# EAGLE board ngff-breakout (EAGLE 7.7.0)
VERSION: v3
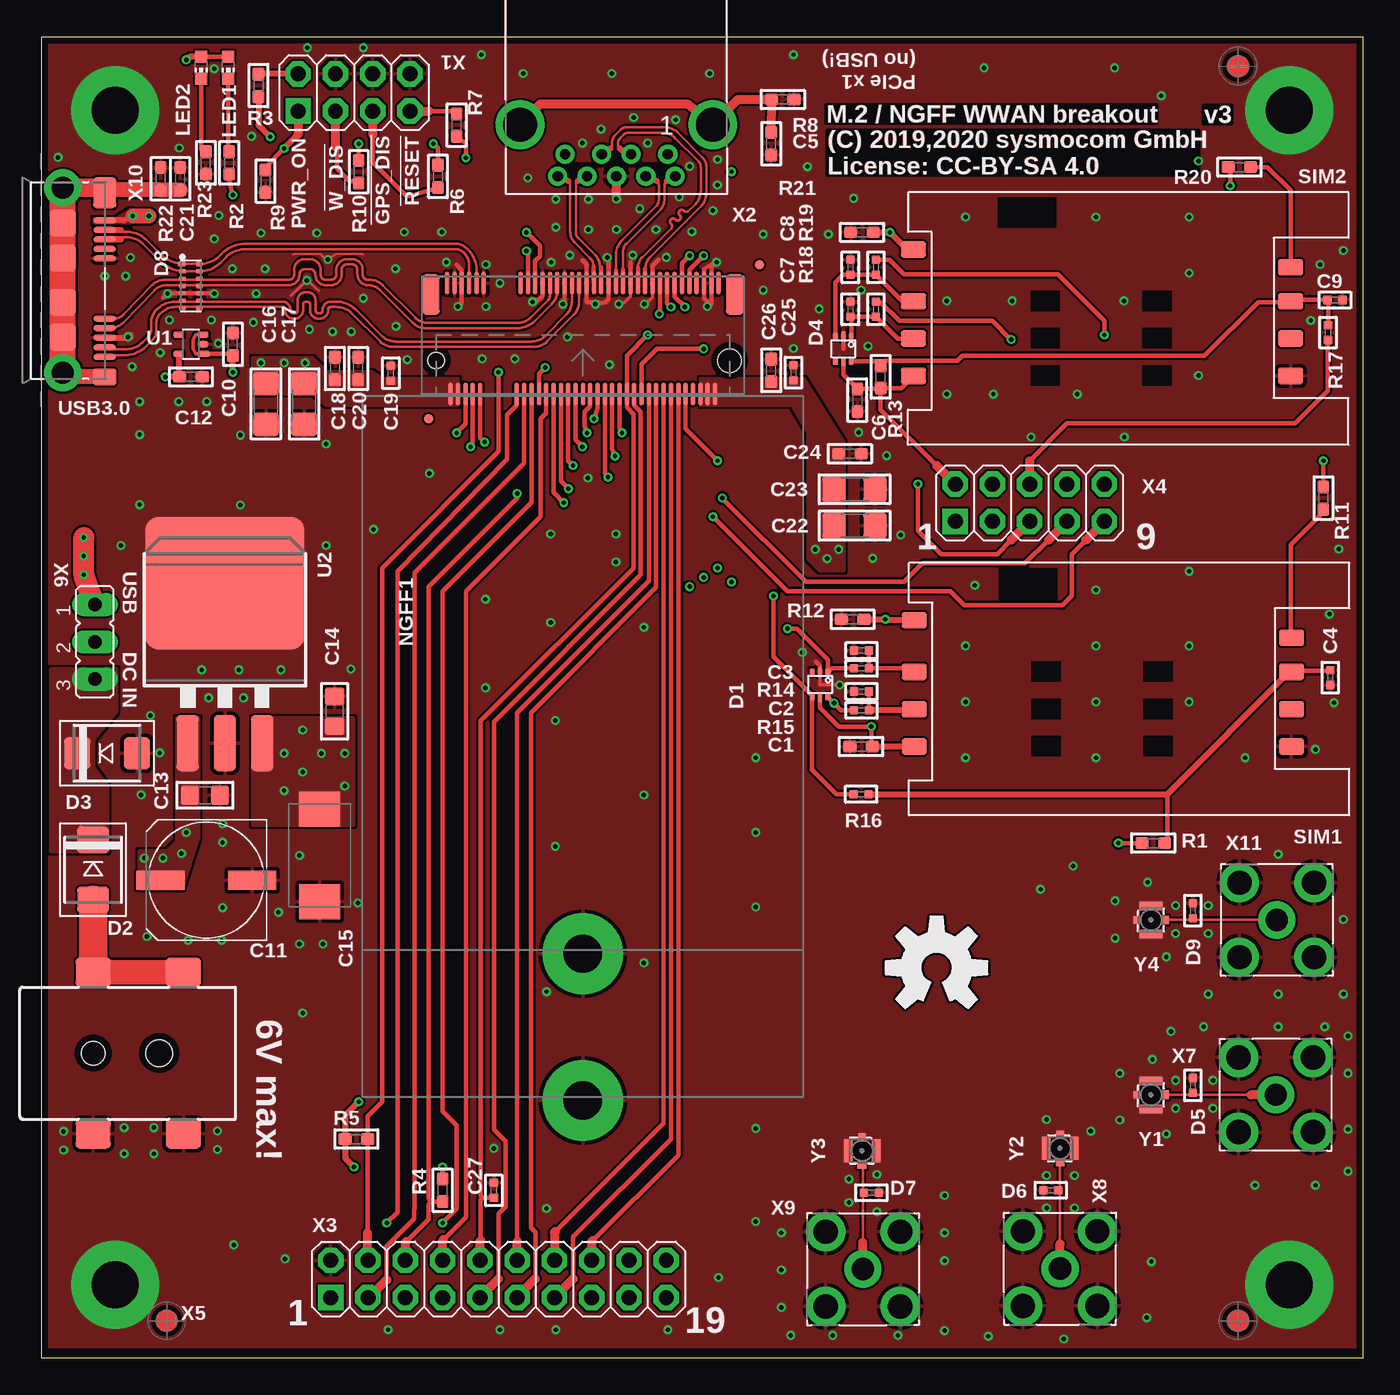
[diagram p1: board, top side]
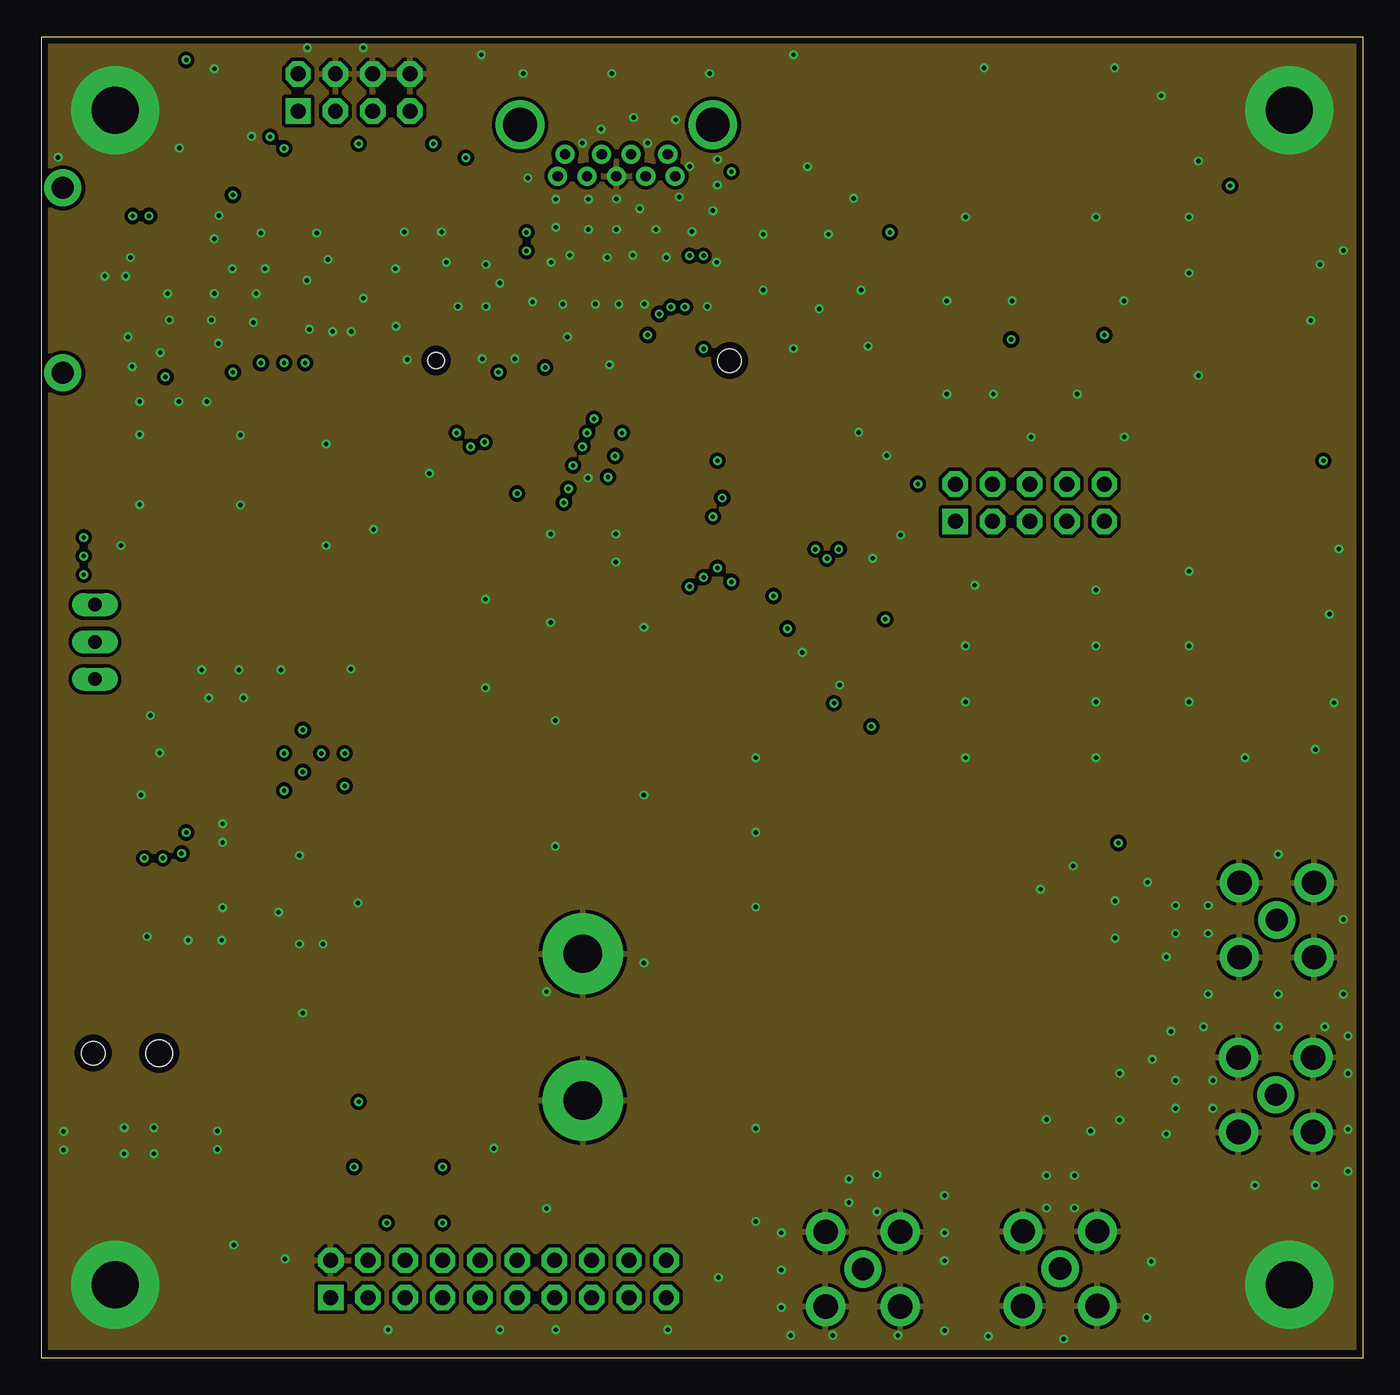
[diagram p2: board, inner layer Route2]
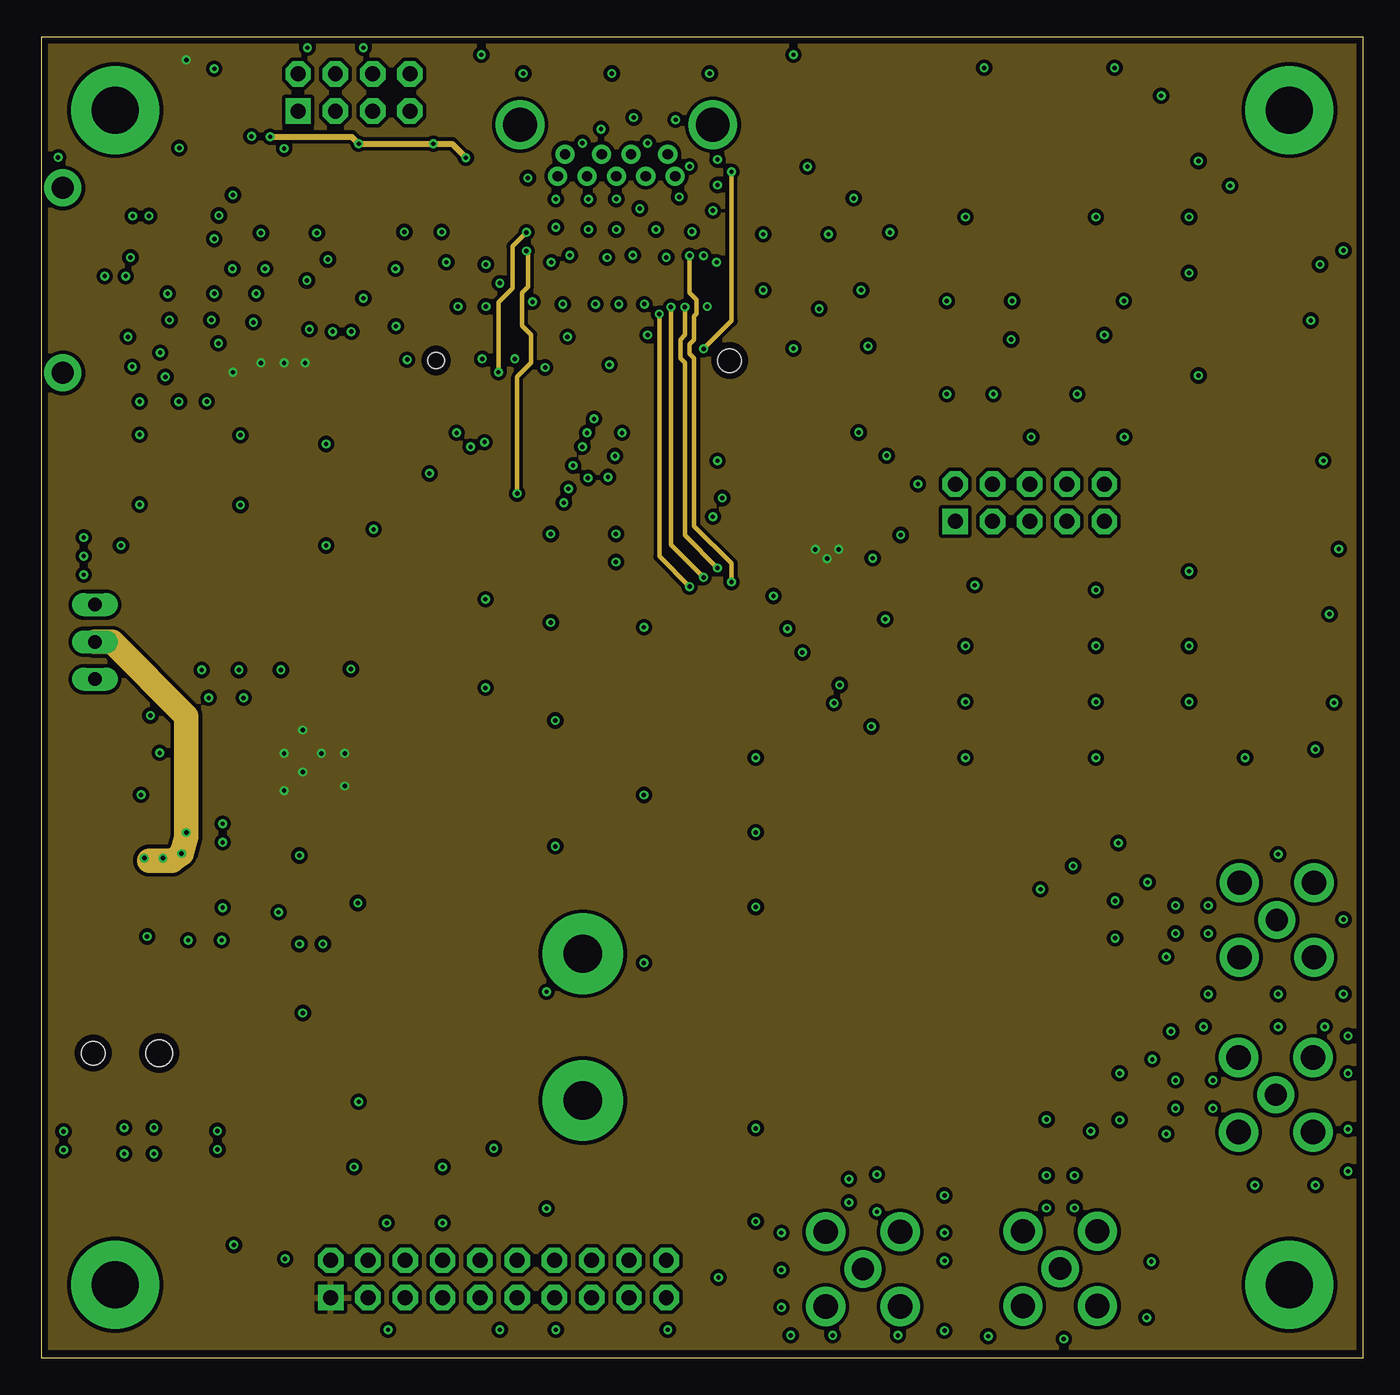
[diagram p3: board, inner layer Route15]
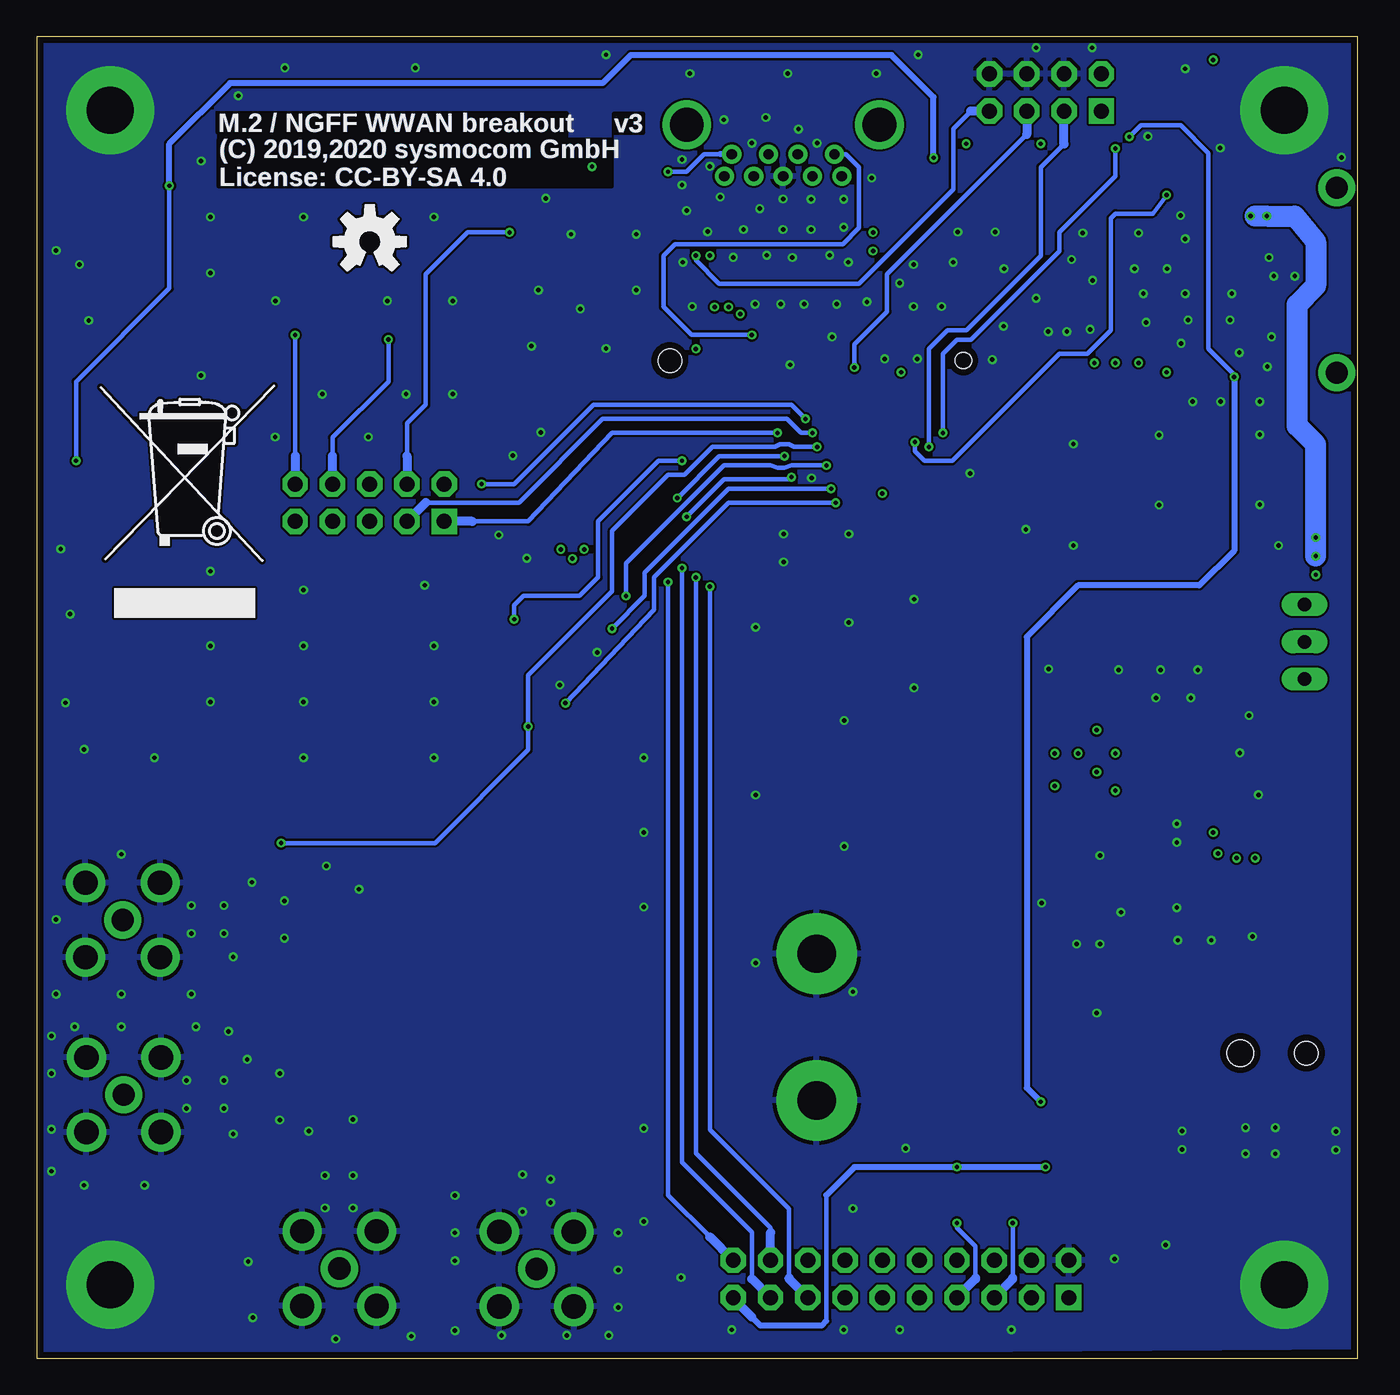
[diagram p4: board, bottom side, seen from below]

Size 90 x 90 mm. Coordinates in mm from the lower left corner, seen from the top.
Outline: 90,0 0,0 0,90 90,90 90,0
Copper layers (1+2*15+16): Top 0.035mm / dielectric 0.46mm / Route2 0.035mm / dielectric 0.55mm / Route15 0.035mm / dielectric 0.46mm / Bottom 0.035mm
Design rules "sysmocom-4layer": minimum track width 0.15mm, minimum drill 0.3mm, track to track 0.15mm, track to pad 0.15mm, pad to pad 0.15mm, via to via 0.15mm, smd to smd 0mil, copper to edge 0.45mm, drill to drill 0.3mm, minimum pad ring 0.15mm, minimum via ring 0.15mm, stop-mask expansion 0mil, vias tented up to drill 0mil, thermal gap 10mil
Net classes: 0 default: clearance 0.25 mm; 1 usb: width 0.185 mm, clearance 0.195 mm; 2 50 ohm: width 0.9 mm, clearance 0.152 mm; 3 supply: width 0.6 mm, clearance 0.3 mm to class 0
tRestrict: area 35.6,81.1 to 42.9,81.4

## Footprints (pad centres in the part's own frame; a part is rotated, then mirrored left to right if it is on the bottom)
_0603 = smd 0.9 x 0.8: 1 -0.762,0; 2 0.762,0
_0402 = smd 0.6 x 0.6: 1 -0.508,0; 2 0.508,0
UD-8X10_NICHICON = smd 3.3 x 1.3: + 3.125,0; - -3.125,0
_0805 = smd 1.2 x 1.3: 1 -1.016,0; 2 1.016,0
SMC_E = smd 2.4 x 2.8: + -3.15,0; - 3.15,0
1206 = smd 1.6 x 1.8: 1 -1.4,0; 2 1.4,0
SOT666 = smd 0.375 x 0.5: 1 -0.538,-0.85; 3 0.538,-0.85; 4 0.538,0.85; 6 -0.538,0.85 | smd 0.3 x 0.6: 2 0,-0.9; 5 0,0.9
SMBDIODE = smd 1.78 x 2.16: A 2.04,0; C -2.03,0
UDFN-14 = smd 0.3 x 0.6: 1 -1.5,-0.625 | smd 0.3 x 0.5: 2 -1,-0.575; 3 -0.5,-0.575; 4 0,-0.575; 5 0.5,-0.575; 6 1,-0.575; 7 1.5,-0.575; 8 1.5,0.575; 9 1,0.575; 10 0.5,0.575; 11 0,0.575; 12 -0.5,0.575; 13 -1,0.575; 14 -1.5,0.575
MICRO-FIDUCIAL = smd 0.635 x 0.635: 1 0,0
CHIP-LED0603 = smd 0.8 x 0.8: A 0,-0.75; C 0,0.75
NGFF_3042_3052_NSOL = smd 0.3 x 1.55: 1 -9.25,5.275; 2 -9,-2.275; 3 -8.75,5.275; 4 -8.5,-2.275; 5 -8.25,5.275; 6 -8,-2.275; 7 -7.75,5.275; 8 -7.5,-2.275; 9 -7.25,5.275; 10 -7,-2.275; 11 -6.75,5.275; 20 -4.5,-2.275; 21 -4.25,5.275; 22 -4,-2.275; 23 -3.75,5.275; 24 -3.5,-2.275; 25 -3.25,5.275; 26 -3,-2.275; 27 -2.75,5.275; 28 -2.5,-2.275; 29 -2.25,5.275; 30 -2,-2.275; 31 -1.75,5.275; 32 -1.5,-2.275; 33 -1.25,5.275; 34 -1,-2.275; 35 -0.75,5.275; 36 -0.5,-2.275; 37 -0.25,5.275; 38 0,-2.275; 39 0.25,5.275; 40 0.5,-2.275; 41 0.75,5.275; 42 1,-2.275; 43 1.25,5.275; 44 1.5,-2.275; 45 1.75,5.275; 46 2,-2.275; 47 2.25,5.275; 48 2.5,-2.275; 49 2.75,5.275; 50 3,-2.275; 51 3.25,5.275; 52 3.5,-2.275; 53 3.75,5.275; 54 4,-2.275; 55 4.25,5.275; 56 4.5,-2.275; 57 4.75,5.275; 58 5,-2.275; 59 5.25,5.275; 60 5.5,-2.275; 61 5.75,5.275; 62 6,-2.275; 63 6.25,5.275; 64 6.5,-2.275; 65 6.75,5.275; 66 7,-2.275; 67 7.25,5.275; 68 7.5,-2.275; 69 7.75,5.275; 70 8,-2.275; 71 8.25,5.275; 72 8.5,-2.275; 73 8.75,5.275; 74 9,-2.275; 75 9.25,5.275 | smd 1.2 x 2.75: MNT1 -10.35,4.5; MNT2 10.35,4.5 | drill 2.6 pad 5.5: P$1 0,-40.394; P$2 0,-50.394 | hole 1.1: -10,0 | hole 1.6: 10,0
SF7W008S1A-RESTR = smd 1.7 x 1.1: 1 12.85,3.9; 2 12.85,1.36; 3 12.85,-1.18; 5 -12.85,3.9; 6 -12.85,1.36; 7 -12.85,-1.18; 81 12.85,-4.7; 82 -12.85,-3.5
SC70-5 = smd 0.4 x 0.8: 1 -0.65,-0.9 | smd 0.4 x 0.7: 2 0,-0.85; 3 0.65,-0.85; 4 0.65,0.85; 5 -0.65,0.85
TO263 = smd 1.524 x 3.81: 1 -2.54,-8.255; 2 0,-8.255; 3 2.54,-8.255 | smd 10.8 x 9: 4 0,2.635
2X04 = drill 1.016 square: 1 -3.81,-1.27 | drill 1.016 octagon: 2 -3.81,1.27; 3 -1.27,-1.27; 4 -1.27,1.27; 5 1.27,-1.27; 6 1.27,1.27; 7 3.81,-1.27; 8 3.81,1.27
692121030100 = drill 0.7 pad 1.3: 1 -3.5,-1.5; 2 -1,-1.5; 3 1,-1.5; 4 3.5,-1.5; 5 4,0; 6 2,0; 7 0,0; 8 -2,0; 9 -4,0 | drill 2.3 pad 3.3: SHELL -6.57,-3.5; SHELL1 6.57,-3.5
2X10 = drill 1.016 square: 1 -11.43,-1.27 | drill 1.016 octagon: 2 -11.43,1.27; 3 -8.89,-1.27; 4 -8.89,1.27; 5 -6.35,-1.27; 6 -6.35,1.27; 7 -3.81,-1.27; 8 -3.81,1.27; 9 -1.27,-1.27; 10 -1.27,1.27; 11 1.27,-1.27; 12 1.27,1.27; 13 3.81,-1.27; 14 3.81,1.27; 15 6.35,-1.27; 16 6.35,1.27; 17 8.89,-1.27; 18 8.89,1.27; 19 11.43,-1.27; 20 11.43,1.27
2X05 = drill 1.016 square: 1 -5.08,-1.27 | drill 1.016 octagon: 2 -5.08,1.27; 3 -2.54,-1.27; 4 -2.54,1.27; 5 0,-1.27; 6 0,1.27; 7 2.54,-1.27; 8 2.54,1.27; 9 5.08,-1.27; 10 5.08,1.27
694108106102 = smd 2.4 x 2: 1 11.15,5.5; 1-1 5,5.5; 2 5,-5.5; 3 11.15,-5.5 | hole 1.6: 5,0 | hole 1.8: 9.5,0
JP2 = drill 0.914 long: 1 -2.54,0; 2 0,0; 3 2.54,0
SMA-F-S-TH = drill 1.524: C 0,0 | drill 1.651: G1 -2.54,2.54; G2 2.54,2.54; G3 -2.54,-2.54; G4 2.54,-2.54
ZX360D-B = smd 0.4 x 1.5: 1 -1.3,0; 2 -0.65,0; 3 0,0; 4 0.65,0; 5 1.3,0; 6 5.4,0; 7 6.05,0; 8 6.7,0; 9 7.35,0; 10 8,0 | drill 1.5: S1 -3.5,-2.85; S2 9.1,-2.85 | smd 2.1 x 1.6: S3 -3.175,0 | smd 1.1 x 1.6: S4 9.366,0 | smd 1.8 x 1.8: S5 -1.111,-2.857; S6 1.27,-2.857; S7 4.286,-2.857; S8 6.668,-2.857
MURATA_HSC = smd 0.6 x 0.55: 1 0,-0.953 | smd 0.58 x 1.58: P$1 -0.953,0; P$2 0.953,0 | smd 0.5 x 0.5: P$4 0,0.953

## Placement (x,y rotation side)
C1  100n  [_0603]  55.82,41.66 0 top
C2  33p  [_0402]  55.85,45.4 180 top
C3  33p  [_0402]  55.85,48.19 180 top
C4  33p  [_0402]  87.79,46.35 270 top
C5  100n  [_0603]  49.69,82.71 90 top
C6  100n  [_0603]  55.56,65.25 90 top
C7  33p  [_0402]  55.09,71.44 90 top
C8  33p  [_0402]  55.09,74.3 90 top
C9  33p  [_0402]  88.11,72.07 0 top
C10  100n  [_0603]  13.02,69.06 270 top
C11  470u  [UD-8X10_NICHICON]  11.21,32.56 180 top
C12  100n  [_0603]  10.16,66.83 180 top
C13  10u  [_0805]  11.11,38.34 180 top
C14  10u  [_0805]  19.94,44.05 270 top
C15  DNP  [SMC_E]  18.92,34.24 270 top
C16  100u  [1206]  15.27,64.99 90 top
C17  100u  [1206]  17.87,64.99 90 top
C18  100n  [_0603]  19.97,67.4 270 top
C19  33p  [_0402]  23.78,67.09 90 top
C20  10p  [_0603]  21.56,67.4 90 top
C21  100n  [_0603]  9.43,80.33 270 top
C22  100u  [1206]  55.37,56.7 180 top
C23  100u  [1206]  55.37,59.18 180 top
C24  100n  [_0603]  55.05,61.59 180 top
C25  33p  [_0402]  51.21,67.12 90 top
C26  10p  [_0603]  49.69,67.28 90 top
C27  33p  [_0402]  30.8,11.43 90 top
D1  PESD5V0UBV  [SOT666]  53.02,45.88 180 top
D2  SD2114S040S5R0  [SMBDIODE]  3.49,33.26 270 top
D3  SMBJP6KE6.8A-TP  [SMBDIODE]  4.45,41.2 0 top
D4  PESD5V0UBV  [SOT666]  54.61,68.74 180 top
D5  GG040205170N2P  [_0402]  78.42,18.57 270 top
D6  GG040205170N2P  [_0402]  68.74,11.43 0 top
D7  GG040205170N2P  [_0402]  56.52,11.27 180 top
D8  SP3012-6UTG  [UDFN-14]  10.16,73.02 270 top
D9  GG040205170N2P  [_0402]  78.42,30.48 270 top
FID1  [VISION_REF15]  81.5,2.54 0 top
FID2  [VISION_REF15]  8.5,2.54 0 top
FID3  [VISION_REF15]  81.5,88 0 top
JP1  FIDUCIALUFIDUCIAL  [MICRO-FIDUCIAL]  48.9,74.45 0 top
JP2  FIDUCIALUFIDUCIAL  [MICRO-FIDUCIAL]  26.35,63.98 0 top
LED1  YELLOW  [CHIP-LED0603]  12.7,87.88 180 top
LED2  GREEN  [CHIP-LED0603]  10.86,87.88 180 top
LOGO1  OSHW-LOGOL-COPPER  [OSHW-LOGO-L_COPPER]  60.96,26.59 0 top
NGFF1  NGFF_B-NSOL  [NGFF_3042_3052_NSOL]  36.86,67.94 0 top
R1  DNP  [_0603]  75.72,35.08 0 top
R2  330  [_0603]  12.76,81.4 270 top
R3  10k  [_0603]  14.76,86.68 270 top
R4  10k  [_0603]  27.3,11.43 90 top
R5  10k  [_0603]  21.43,14.92 180 top
R6  10k  [_0603]  26.99,80.48 90 top
R7  10k  [_0603]  28.26,83.98 270 top
R8  330  [_0603]  50.48,85.72 180 top
R9  100k  [_0603]  15.24,80.17 90 top
R10  10k  [_0603]  21.59,80.8 90 top
R11  4.7k  [_0603]  87.31,58.58 270 top
R12  47k  [_0603]  55.24,50.32 0 top
R13  DNP  [_0603]  57.15,66.83 90 top
R14  47  [_0402]  55.85,46.99 0 top
R15  47  [_0402]  55.85,44.13 0 top
R16  47  [_0402]  55.82,38.42 0 top
R17  47  [_0402]  87.63,69.85 90 top
R18  47  [_0402]  56.83,71.44 270 top
R19  47  [_0402]  56.83,74.29 270 top
R20  4.7k  [_0603]  81.6,81.12 0 top
R21  47k  [_0603]  55.88,76.67 0 top
R22  330  [_0603]  8.1,80.33 270 top
R23  330  [_0603]  11.18,81.4 90 top
SIM1  SF7W008S1A-R  [SF7W008S1A-RESTR]  72.29,45.56 180 top
SIM2  SF7W008S1A-R  [SF7W008S1A-RESTR]  72.23,70.8 180 top
U1  MIC5366-1.8YC5  [SC70-5]  10.16,69.06 90 top
U2  MCP1827S-3302E/EB  [TO263]  12.48,50.15 0 top
U$1  [WEEE_BIN_TOP]  80.33,59.53 0 bottom
U$2  [WEEE_BIN]  80.33,56.99 0 bottom
U$3  [OSHW-LOGO-M_COPPER]  67.31,76.04 0 bottom
U$4  [OSHW-LOGO-M]  67.31,76.04 0 bottom
U$7  [OSHW-LOGO-L]  60.96,26.59 0 top
X1  PINHD-2X4  [2X04]  21.27,86.2 0 top
X2  692121030100  [692121030100]  39.15,80.5 180 top
X3  PINHD-2X10  [2X10]  31.11,5.4 0 top
X4  PINHD-2X5  [2X05]  67.31,58.26 0 top
X5  PJ-002BH-SMT-TR  [694108106102]  -1.5,20.78 0 top
X6  PINHD-1X3  [JP2]  3.62,48.78 270 top
X7  5-1814832-2  [SMA-F-S-TH]  84.07,17.94 180 top
X8  5-1814832-2  [SMA-F-S-TH]  69.37,6.1 90 top
X9  5-1814832-2  [SMA-F-S-TH]  55.94,6.06 0 top
X10  ZX360D-B-10P(30)  [ZX360D-B]  4.29,76.2 270 top
X11  5-1814832-2  [SMA-F-S-TH]  84.14,29.84 270 top
Y1  MHF4  [MURATA_HSC]  75.56,17.94 90 top
Y2  MHF4  [MURATA_HSC]  69.37,14.29 0 top
Y3  MHF4  [MURATA_HSC]  55.88,14.13 0 top
Y4  MHF4  [MURATA_HSC]  75.56,29.84 90 top

## Tracks (layer width: path | path; a pad name or v marks a point on that pad's centre or on a via)
!BODY_SAR  (via drill 0.3)
  Top 0.254: X3.4 22.19,6.7 22.19,6.99
  Top 0.305: NGFF1.25 33.61,74.73 33.93,75.04 33.93,75.77 v33.02,76.67 | v31.11,67.15 31.11,61.75 23.5,54.1 23.18,53.78 23.18,17.46 22.19,16.48 R5.1 22.19,8.54
  Top 0.61: 22.19,6.71 22.19,6.99 22.19,8.54
  Route15 0.305: v33.02,76.67 32.07,75.72 32.07,72.86 31.11,71.91 v31.11,67.15
!CLKREQ
  Top 0.254: 29.91,4.19 X3.9
  Top 0.305: NGFF1.52 40.36,64.89 40.8,64.45 40.8,53.34 30.8,43.34 30.8,15.56 31.59,14.76 31.59,10.32 31.11,9.84 31.11,5.4
  Top 0.6: 29.91,4.19 31.11,5.4
!GPS_DISABLE  (via drill 0.3)
  Top 0.305: NGFF1.26 33.86,67.04 v34.29,67.47 | 22.54,83.34 22.54,81.44 24.89,79.09 R6.1
  Top 0.6: X1.5 22.54,83.34
  Bottom 0.305: v34.29,67.47 34.29,69.06 32.07,71.28 32.07,73.82 22.54,83.34
  Bottom 0.6: X1.5 22.54,83.34
!PERST  (via drill 0.3)
  Top 0.305: 29.91,8 29.91,10.79 30.04,10.92 | v41.27,69.69 39.86,68.28 NGFF1.50 39.86,64.75 40.32,64.29 40.32,53.81 29.91,43.4 29.91,11.05 30.04,10.92 | C27.1 30.04,10.92
  Top 0.61: 29.91,8 29.86,7.95 29.86,6.68 X3.10
  Bottom 0.305: v41.27,69.69 45.4,69.69 47.31,71.59 47.31,75.09 46.51,75.88 35.08,75.88 33.97,76.99 33.97,81.12 34.85,82 X2.4
!RESET  (via drill 0.3)
  Top 0.305: NGFF1.67 44.11,74.11 v45.09,75.09 | 26.35,84.93 28.07,84.93 R7.1
  Top 0.6: X1.7 26.35,84.93
  Bottom 0.305: v45.09,75.09 45.09,74.77 43.5,73.18 33.97,73.18 27.56,79.6 27.56,83.72 26.35,84.93
  Bottom 0.6: X1.7 26.35,84.93
!USIM1_RESET
  Top 0.305: R15.2 C2.1
  Top 0.406: SIM1.2 59.38,44.13 R15.2
!USIM2_RESET
  Top 0.305: 58.79,69.44 SIM2.2 58.32,69.44 R18.2 C7.1 55.15,70.87 D4.1
!W_DISABLE  (via drill 0.3)
  Top 0.305: NGFF1.8 29.36,62.22 v29.21,62.07 | R10.1 21.78,80.17 20.95,80.17 20.13,80.99 20.13,82.39
  Top 0.406: 20.13,82.39 20,82.52
  Top 0.6: 20,82.52 X1.3
  Bottom 0.305: v29.21,62.07 29.21,68.74 27.94,70.01 26.67,70.01 21.59,75.09 21.59,81.12 20.13,82.58
  Bottom 0.406: 20.13,82.58 20,82.71
  Bottom 0.6: 20,82.71 X1.3
!WAKE  (via drill 0.3)
  Top 0.305: NGFF1.54 40.86,67.69 41.91,68.74 v45.09,68.74
  Route15 0.305: v45.09,68.74 46.99,70.64 v46.99,80.8
  Bottom 0.305: 43.42,82 44.52,82 45.72,80.8 v46.99,80.8
  Bottom 0.406: X2.1 43.42,82
!WAKE_ON_WWAN  (via drill 0.3)
  Top 0.305: 24.83,7.94 26.35,9.46 26.35,10.48 26.54,10.67 | R4.1 26.54,10.67 | v32.38,58.9 32.38,58.58 26.35,52.55 26.35,10.86 26.54,10.67 | v33.02,75.41 33.11,75.31 NGFF1.23
  Top 0.61: 24.83,7.94 24.78,7.89 X3.6
  Route15 0.305: v32.38,58.9 32.38,66.83 33.34,67.78 33.34,69.69 32.7,70.33 32.7,72.55 33.11,72.96 33.11,75.31 v33.02,75.41
_!USIM1_RESET  (via drill 0.3)
  Top 0.305: R15.1 54.46,44.13 v53.98,44.61 | NGFF1.30 34.86,58.96 v35.56,58.26 | v53.98,44.61 D1.6 | v53.98,44.61
  Bottom 0.305: v35.56,58.26 42.86,58.26 47.94,53.18 47.94,50.96 v53.98,44.61
_!USIM2_RESET  (via drill 0.3)
  Top 0.305: NGFF1.46 38.86,61.94 v39.05,61.44 | 68.58,55.72 66.99,54.13 60.01,54.13 58.74,52.86 52.07,52.86 v46.35,58.58
  Top 0.61: X4.7 68.58,55.72
  Bottom 0.305: v39.05,61.44 43.5,61.44 v46.35,58.58
_SIM2_DET  (via drill 0.3)
  Top 0.305: NGFF1.40 37.36,64.82 36.99,64.45 36.99,63.5 v37.15,63.02
  Bottom 0.305: v37.15,63.02 37.94,63.02 38.89,63.98 51.44,63.98 57.15,58.26 63.5,58.26
  Bottom 0.61: 63.5,58.26 X4.3
_USB_D_N
  Top 0.18: NGFF1.9 29.61,74.11 arc45 29.02,75.53 arc45 28.13,75.91 13.92,75.91 arc45 12.25,75.22 12.14,75.11 arc-45 D8.14 9.74,74.52 arc-45 8.07,75.22 7.11,76.17 arc45 5.77,76.72 5.48,76.72 5.4,76.85
  Top 0.406: X10.2 5.4,76.85
_USB_D_P
  Top 0.152: 5.4,76.2 5.24,76.2
  Top 0.18: X10.3 arc-45 4.61,76.33 5.83,76.33 arc-45 6.86,75.91 8,74.77 arc45 9.8,74.02 D8.13 arc45 12.17,74.62 12.51,74.96 arc-45 13.92,75.54 28.13,75.54 arc-45 28.76,75.28 arc-45 29.11,74.44 NGFF1.7
  Top 0.406: X10.3 5.4,76.2
_USIM1_CLK  (via drill 0.3)
  Top 0.305: v35.88,59.21 35.36,59.73 NGFF1.32 | R14.1 53.82,46.99 D1.1 53.56,47.56 51.44,49.69 v50.8,49.69
  Bottom 0.305: v35.88,59.21 42.86,59.21 48.58,53.5 48.58,51.91 v50.8,49.69
_USIM1_DATA  (via drill 0.3)
  Top 0.305: R16.1 54.13,38.42 52.48,40.07 D1.4 52.48,45.15 49.85,47.78 v49.85,51.91 | NGFF1.34 35.86,61.13 v36.2,60.8
  Bottom 0.305: v36.2,60.8 38.58,60.8 39.05,60.64 39.53,60.64 40.01,60.8 43.18,60.8 49.85,54.13 v49.85,51.91
_USIM2_CLK  (via drill 0.3)
  Top 0.305: NGFF1.44 38.36,60.22 v38.58,60.01 | 71.12,55.72 70.17,54.77 70.17,51.91 69.53,51.27 62.87,51.27 61.91,52.23 50.8,52.23 v45.72,57.31
  Top 0.61: X4.9 71.12,55.72
  Bottom 0.305: v45.72,57.31 43.18,59.85 38.73,59.85 v38.58,60.01
_USIM2_DATA  (via drill 0.3)
  Top 0.305: v37.62,63.98 37.86,64.69 NGFF1.42 | v59.69,59.53 59.69,56.35 61.28,54.77 65.09,54.77 66.04,55.72
  Top 0.61: X4.5 66.04,55.72
  Bottom 0.305: v37.62,63.98 38.58,64.93 52.07,64.93 57.47,59.53 v59.69,59.53
_USIM2_POWER  (via drill 0.3)
  Top 0.305: NGFF1.48 39.36,63.33 v39.53,63.02
  Bottom 0.305: v39.53,63.02 50.8,63.02 56.52,56.99 60.33,56.99
  Bottom 0.61: 60.33,56.99 X4.1
ANTCTL0  (via drill 0.3)
  Top 0.305: NGFF1.59 42.11,71.16 v42.07,71.12
  Route15 0.305: v44.13,52.55 42.07,54.61 v42.07,71.12
  Bottom 0.305: 38.73,5.46 38.73,10.16 44.13,15.56 v44.13,52.55
  Bottom 0.61: X3.15 38.73,5.4 38.73,5.46
ANTCTL1  (via drill 0.3)
  Top 0.305: NGFF1.61 42.61,71.85 v42.86,71.59
  Route15 0.305: v42.86,71.59 42.86,55.4 v45.09,53.18
  Bottom 0.305: 40.01,8.57 40.01,8.89 45.09,13.97 v45.09,53.18 | 40.01,6.73 X3.18
  Bottom 0.61: 40.01,6.73 40.01,8.57
ANTCTL2  (via drill 0.3)
  Top 0.305: NGFF1.63 43.11,72.3 v43.81,71.59
  Route15 0.305: v46.04,53.81 43.81,56.04 43.81,67.78 43.5,68.1 43.5,69.37 43.81,69.69 v43.81,71.59
  Bottom 0.254: 40.07,4.19 X3.17
  Bottom 0.305: 41.27,5.4 41.27,8.57 46.04,13.34 v46.04,53.81
  Bottom 0.6: 40.07,4.19 41.27,5.4
ANTCTL3  (via drill 0.3)
  Top 0.305: NGFF1.65 43.61,74.57 v44.13,75.09
  Route15 0.305: v44.13,75.09 44.13,72.55 44.61,72.07 44.61,71.12 44.45,70.96 44.45,69.37 44.13,69.06 44.13,68.42 44.45,68.1 44.45,56.67 46.99,54.13 v46.99,52.86
  Bottom 0.305: 44.13,8.26 46.99,11.11 v46.99,52.86
  Bottom 0.61: X3.20 44.13,8.26
COEX1
  Top 0.305: 37.53,8 43.36,13.83 NGFF1.64
  Top 0.61: 37.53,8 37.47,7.94 X3.16
COEX2
  Top 0.254: 34.99,4.19 X3.13
  Top 0.305: 36.2,5.4 36.2,8.26 42.86,14.92 NGFF1.62
  Top 0.6: 34.99,4.19 36.2,5.4
COEX3
  Top 0.305: 34.99,8.64 42.36,16.01 NGFF1.60
  Top 0.61: 34.99,8.64 34.92,8.57 X3.14
GND  (via drill 0.3, 3.2 pad 6)
  Top 0.152: 17.12,75.17 19.02,75.17 19.3,74.83 v19.49,74.83 19.98,75.17 21.88,75.17 | v18.07,73.4 18.89,72.71
  Top 0.2: v18.07,73.4 16.99,72.39
  Top 0.254: 54.29,45.88 53.02,45.88 D1.2 53.02,47.15 | 38.42,75.09 38.58,74.77 | NGFF1.51 40.11,72.34 39.69,71.91 | NGFF1.57 41.61,72.25 41.27,71.91
  Top 0.305: v28.35,71.63 28.61,71.89 NGFF1.5 28.61,74.05 arc45 28.57,74.14 28.26,74.45 | NGFF1.57 41.61,74.41 42.01,74.8 | NGFF1.51 40.11,74.65 | NGFF1.27 34.11,72.37 33.66,71.91 33.4,71.91 v33.43,71.94 | NGFF1.33 35.61,72.06 v35.5,71.78 | v11.75,72.5 11.69,72.52 D8.10 8.55,72.52 8.26,72.23 | 54.61,68.74 D4.2 54.61,69.69 | 36.83,74.77 37.11,74.49 NGFF1.39 37.11,71.95 37.15,71.91 37.91,71.91 v37.72,71.78 38.42,71.91 38.61,72.11 NGFF1.45 38.61,74.58 38.58,74.77 | 52.74,47.43 53.02,47.15 | v54.36,45.85 54.32,45.85 54.29,45.88 | NGFF1.71 45.11,72.2 45.4,71.91 45.4,71.59 45.61,71.8 NGFF1.73 45.61,74.34 46.04,74.77 45.11,74.16 NGFF1.71
  Top 0.406: X10.8 6.03,69.5 6.03,69.69
  Top 0.61: v39.15,78.94 39.15,80.71
  other vias: 13.53,62.86 5.61,15.7 7.64,15.7 11.96,15.48 5.61,13.92 7.64,13.92 1.48,15.44 1.48,14.17 11.96,14.21 85,5 85,85 5,85 16.57,6.76 17.78,23.51 9.97,28.46 12.26,28.46 7.18,28.72 11.24,65.15 6.67,65.15 6.67,62.89 5.87,69.56 5,5 24.89,68.01 21.08,69.91 19.81,69.91 18.22,70.07 14.41,70.55 11.56,70.7 51.21,68.77 87.09,74.48 86.45,70.67 88.68,75.44 55.66,63.05 57.56,61.47 58.52,56.07 86.77,41.46 87.72,50.67 88.04,44.64 51.21,88.77 52.16,81.15 45.97,74.64 45.34,71.63 34.7,74.64 35.97,75.12 30.26,74.48 30.26,71.63 31.21,73.21 4.29,73.69 6.03,74.96 5.71,73.69 14.29,83.21 21.91,89.25 18.1,89.25 38.51,74.96 33.12,80.37 35.02,78.93 35.02,77.02 41.05,71.78 39.31,71.78 35.81,69.56 12.06,77.82 67.41,62.74 73.75,62.74 9.33,65.15 12.99,74.2 15.21,74.2 24.1,74.2 58.33,1.56 53.88,1.56 50.39,3.46 68.04,31.94 76.93,22.26 79.15,22.57 87.41,22.57 89,21.94 89,19.4 89,15.59 86.77,11.78 75.28,2.76 64.48,1.49 75.6,6.57 69.63,1.3 61.5,11.08 61.5,6.64 61.5,1.87 51.02,1.56 50.39,6 50.39,8.54 71.47,15.46 76.61,15.27 82.64,11.78 89,12.73 84.23,22.57 73.44,16.22 73.44,19.4 70.26,33.53 1.11,81.79 9.37,82.42 27.56,74.64 8.57,72.5 21.91,72.19 24.13,70.28 30,68.06 32.23,68.06 14.61,72.5 18.73,76.63 34.38,10.19 61.5,8.54 19.14,28.21 17.56,34.24 21.05,46.94 23.59,1.94 31.21,1.94 35.02,1.94 88.36,55.12 11.75,76.23 27.24,76.71 8.7,70.7 6.16,67.53 8.06,68.48 12.03,69.12 14.92,76.63 24.7,76.71 11.75,87.82 51.82,48.07 56.29,68.93 55.82,72.74 56.9,12.51 54.99,12.19 54.99,10.61 56.9,9.97 70.36,12.45 70.36,10.22 68.45,12.45 68.45,10.22 68.45,16.26 77.25,18.92 79.79,18.92 77.25,17.02 79.79,17.02 75.66,20.35 12.32,36.4 21.53,31 17.56,28.21 16.13,30.37 12.32,30.68 12.32,35.13 6.76,38.37 7.4,43.77 8.03,41.23 13.75,44.97 11.37,44.97 16.29,46.88 13.43,46.88 10.89,46.88 42.64,1.94 56.61,54.48 34.99,43.43 41.02,49.78 34.99,34.86 41.02,38.35 41.02,26.92 26.42,60.26 64.2,87.88 73.09,87.88 55.31,78.99 71.82,77.72 78.17,77.72 78.17,73.91 78.8,66.93 78.17,53.59 71.82,52.32 78.17,48.51 62.93,40.89 62.93,48.51 81.98,40.89 48.64,40.89 48.64,35.81 48.64,30.73 48.64,15.65 48.64,9.3 46.1,5.49 13.08,7.71 38.67,67.66 49.15,72.74 49.15,76.55 53.59,76.55 52.96,71.47 62.93,77.72 66.1,72.01 61.66,72.01 73.72,72.01 61.66,65.66 64.83,65.66 70.55,65.66 62.93,44.7 71.82,48.51 71.82,44.7 71.82,40.89 78.17,44.7 34.38,24.95 5.4,55.35 19.37,55.35 19.37,62.26 30.23,45.65 30.23,51.69 34.67,56.13 39.12,56.13 39.12,54.23 37.21,59.94 34.67,50.1 22.61,56.45 29.94,88.77 32.8,87.5 45.5,87.5 38.83,87.5 63.56,52.64 36.83,82.75 30.8,14.29 41.27,82.75 44.13,81.17 46.04,81.64 46.04,79.9 45.72,78.15 40.26,75.12 41.85,76.86 43.43,79.09 37.24,76.86 37.24,78.93 39.15,76.86 40.73,78.29 38.1,83.71 43.18,84.34 40.32,84.5 42.55,74.98 44.29,76.72 13.53,58.1 6.67,58.13 88.68,29.88 88.68,24.8 84.23,24.8 79.47,24.8 79.47,28.92 79.47,30.83 77.25,30.83 77.25,28.92 75.34,32.42 73.12,31.15 73.12,28.61 76.61,27.34 84.23,34.32 76.26,85.98 78.8,81.53
  pour Top (rank 6): 90.1,89.98 -0.25,89.98 -0.25,0.76 90.1,0.76
  pour Bottom (rank 6): 90,90 0,90 -0.25,0.76 90.1,0.13
  pour Route2 (isolate 0.254): 89.92,89.6 -0.25,89.6 -0.25,0.76 89.92,0.76
  pour Top (no thermals): 6.67,62.39 18.41,62.39 18.41,47.86 6.67,47.86
  pour Top (no thermals): 76.83,19.68 73.98,19.68 73.98,16.19 76.83,16.19 76.83,17.14 74.61,17.14 74.61,18.73 76.83,18.73
  pour Top (no thermals): 71.12,13.18 71.12,15.72 67.63,15.72 67.63,13.18 68.58,13.18 68.58,15.08 70.17,15.08 70.17,13.18
  pour Top (no thermals): 57.63,13.02 57.63,15.56 54.13,15.56 54.13,13.02 55.09,13.02 55.09,14.92 56.67,14.92 56.67,13.02
  pour Top (no thermals): 76.56,31.59 74.02,31.59 74.02,28.1 76.56,28.1 76.56,29.05 74.65,29.05 74.65,30.64 76.56,30.64
LDO_IN  (via drill 0.3)
  Route15 1.676: X6.2 4.79,48.78 9.84,43.73 9.84,35.48 v9.53,34.37 8.89,33.89 7.3,33.89
  other vias: 9.84,35.8 6.99,34.05 8.26,34.05
  pour Top (isolate 0.305, no thermals): 6.67,31.99 6.67,34.53 8.57,34.53 9.21,35.16 9.21,43.58 10.64,43.58 10.64,35.48 9.53,31.99
N$1
  Top 0.305: LED2.C 10.86,82.33 11.11,82.07 R23.2
N$2
  Top 0.305: LED1.C 12.7,82.39 12.76,82.33 R2.1
N$3
  Top 1.676: X5.1 X5.1-1 3.49,27.24
  Top 1.93: 3.49,27.24 D2.A
N$4
  Top 0.6: X2.SHELL1 32.58,84.03 33.97,85.42 43.98,85.42 X2.SHELL | R8.2 C5.2
  Top 0.61: X2.SHELL 47.44,85.72 R8.2
N$6  (via drill 0.3)
  Top 0.305: NGFF1.10 29.86,62.69 v30.16,62.39 | R2.2 12.76,80.23 v13.02,79.22
  Bottom 0.305: v30.16,62.39 30.16,61.75 29.53,61.12 27.62,61.12 20.32,68.42 18.41,68.42 16.83,70.01 16.83,77.63 16.51,77.94 13.97,77.94 v13.02,79.22
N$7
  Top 0.152: D7.2 56.01,11.37 55.94,11.43
  Top 0.18: X9.C 55.94,11.43 55.94,13.11
  Top 0.254: 55.94,13.11 Y3.1
  Top 0.6: X9.C 55.94,7.87
N$9
  Top 0.305: SIM1.82 85.09,49.11 85.09,55.4 87.31,57.62 R11.2
N$10
  Top 0.5: 8.72,79.56 R22.2
  Top 0.6: 1.7,66.83 X10.S2 | X10.S8 | X10.S1
  Top 1.016: C21.2 R22.2 4.48,79.56 X10.S3 | X10.S4 1.7,66.83
  Top 1.27: X10.S1 3.96,79.7 X10.S3
  Top 1.778: X10.S2 X10.S8 | X10.S8 X10.S7 X10.S6 X10.S5 X10.S1
N$11
  Top 0.305: SIM2.82 85.08,79.54 83.5,81.12 R20.2
N$12
  Top 0.406: 2.67,36.11 D2.C
  pour Top (isolate 0.305, no thermals): 0.64,46.91 5.08,46.91 5.08,44.05 3.49,42.15 3.49,40.24 4.45,38.97 4.45,34.53 0.64,34.53
N$13
  Top 0.152: D5.2 78.42,17.94
  Top 0.18: Y1.1 78.42,17.94 82.39,17.94
  Top 0.6: X7.C 82.39,17.94
N$14
  Top 0.152: D6.2 69.37,11.43
  Top 0.18: Y2.1 69.37,11.43 X8.C
  Top 0.6: X8.C 69.37,7.78
N$15
  Top 0.305: 67.31,61.12 69.85,63.66 85.41,63.66 87.63,65.88 R17.1
  Top 0.61: X4.6 67.31,61.12
N$16  (via drill 0.3)
  Top 0.305: R18.1 57.12,71.94 58.42,70.64 64.77,70.64 v66.04,69.37
  Bottom 0.305: v66.04,69.37 66.04,66.52 69.85,62.7 69.85,61.44
  Bottom 0.61: X4.8 69.85,61.44
N$18
  Top 0.406: X1.2 14.8,87.47 R3.1
N$19  (via drill 0.3)
  Top 0.305: R19.1 57.75,74.8 58.74,73.82 69.22,73.82 72.39,70.64 v72.39,69.69
  Bottom 0.305: v72.39,69.69 72.39,61.44
  Bottom 0.61: 72.39,61.44 X4.10
N$20
  Top 0.18: Y4.1 78.3,29.84 D9.2 78.55,29.84 X11.C
PCIE_RX_N
  Top 0.185: 39.11,74.11 39.11,75.11 arc-45 39.55,76.17 41.87,78.49 arc45 42.04,78.9 42.04,79.86 arc45 41.91,80.17
  Top 0.305: NGFF1.47 39.11,74.11
  Top 0.406: X2.8 arc-45 41.34,80.42 41.91,80.17
PCIE_RX_P
  Top 0.185: 39.61,74.12 39.61,75.4 arc-45 39.82,75.91 42.14,78.22 arc45 42.42,78.9 42.42,79.85 arc-45 42.54,80.14 42.58,80.18
  Top 0.305: NGFF1.49 39.61,74.12
  Top 0.406: X2.9 42.58,80.18
PCIE_TX_N
  Top 0.185: 37.6,74.29 37.6,74.31 arc45 37.33,74.95 36.28,76 arc-45 36.01,76.67 36.01,80.17 arc45 35.98,80.06 35.88,80.17
  Top 0.305: 37.6,74.29 37.6,73.25 NGFF1.41
  Top 0.406: X2.5 arc45 35.18,80.48 35.88,80.17
PCIE_TX_P
  Top 0.185: 38.11,74.29 38.03,74.29 arc45 37.68,75.14 36.55,76.27 arc-45 36.38,76.67 36.38,80.17 36.49,80.27 arc45 36.51,80.17
  Top 0.305: NGFF1.43 arc-45 NGFF1.43 38.11,74.29
  Top 0.406: X2.6 36.51,80.17
PCM_CLK  (via drill 0.3)
  Top 0.305: NGFF1.20 32.36,64.9 31.7,64.25 31.7,61.23 24.24,53.61 24.24,9.95 v23.5,9.21
  Bottom 0.305: v23.5,9.21 23.5,5.46
  Bottom 0.61: X3.5 23.5,5.4 23.5,5.46
PCM_DIN
  Top 0.254: X3.3 22.29,4.13
  Top 0.305: NGFF1.22 32.86,60.96 25.4,53.5 25.4,10.16 25.38,10.14 25.38,9.5 23.5,7.62 23.5,5.33
  Top 0.61: 23.5,5.33 22.29,4.13
PCM_DOUT  (via drill 0.3)
  Top 0.305: NGFF1.24 33.36,58.28 27.3,52.23 27.3,16.83 28.26,15.88 28.26,10.16 v27.3,9.21
  Bottom 0.305: v27.3,9.21 27.3,8.89 26.04,7.62 26.04,5.46
  Bottom 0.61: X3.7 26.04,5.4 26.04,5.46
PCM_SYNC
  Top 0.305: NGFF1.28 34.36,64.36 33.97,63.98 33.97,57.31 28.89,52.23 28.89,9.6 27.37,8.07
  Top 0.61: 27.37,8.07 27.32,8.02 27.32,6.68 X3.8
PWR_ON  (via drill 0.3)
  Top 0.305: NGFF1.6 28.86,63.63 v28.26,63.02 | v16.51,82.39 15.24,81.12 R9.2
  Top 0.406: 17.46,83.34 v16.51,82.39
  Top 0.6: X1.1 17.46,83.34
  Bottom 0.305: v28.26,63.02 28.26,68.42 27.3,69.37 26.35,69.37 20.32,75.41 20.32,76.67 16.51,80.48 v16.51,82.39
REFCLK_N
  Top 0.18: 40.62,74.28 arc-45 40.61,74.27
  Top 0.185: 40.62,74.28 arc-45 40.91,75 42.89,76.97 arc90 42.89,77.24 42.85,77.27 arc-90 42.85,77.54 42.88,77.57 arc-90 43.15,77.57 43.18,77.53 arc90 43.45,77.53 43.48,77.56 arc90 43.48,77.83 43.44,77.86 arc-90 43.44,78.13 43.47,78.16 arc-90 43.73,78.16 43.77,78.12 arc90 44.04,78.12 44.52,78.6 arc45 44.9,79.5 44.9,81.12 arc45 44.73,81.53 43.16,83.1 arc45 42.26,83.47 40.01,83.47 arc45 39.6,83.3 39.41,83.11 arc45 39.24,82.71 39.24,82.7 arc45 39.37,82.39
  Top 0.305: NGFF1.53 40.61,74.27
  Top 0.406: X2.2 39.76,82.07 39.37,82.39
REFCLK_P
  Top 0.185: 41.11,74.18 arc-45 41.45,74.99 44.9,78.45 arc45 45.27,79.34 45.27,81.12 arc45 44.99,81.8 43.31,83.48 arc45 42.41,83.85 39.87,83.85 arc45 39.42,83.66 39.05,83.29 arc45 38.86,82.84 38.86,82.7 arc-45 38.73,82.39
  Top 0.305: NGFF1.55 41.11,74.18
  Top 0.406: X2.3 38.1,82.05 38.73,82.39
SIM1_DET  (via drill 0.3)
  Top 0.305: NGFF1.66 43.86,63.29 v46.04,61.12
  Top 0.406: SIM1.81 57.53,50.26 v57.47,50.32 R12.2
  Bottom 0.305: v57.47,50.32 57.47,51.27 56.83,51.91 53.02,51.91 51.75,53.18 51.75,56.99 47.62,61.12 v46.04,61.12
SIM2_DET  (via drill 0.3)
  Top 0.406: SIM2.81 58.96,75.5 v57.78,76.67 R21.2
  Bottom 0.305: v57.78,76.67 60.64,76.67 63.5,73.82 63.5,64.93 64.77,63.66 64.77,61.44
  Bottom 0.61: 64.77,61.44 X4.4
SMB_CLK
  Top 0.254: X3.11 32.4,4.14 32.4,4.19
  Top 0.305: NGFF1.58 41.86,52.5 33.34,43.97 33.34,8.89 33.66,8.57 33.66,5.45 33.6,5.4
  Top 0.61: 33.6,5.4 32.4,4.19
SMB_DATA
  Top 0.254: 32.38,6.73 X3.12
  Top 0.305: NGFF1.56 41.36,52.95 32.38,43.97 32.38,7.94
  Top 0.6: 32.38,6.73 32.38,7.94
USB3.0_RX_N
  Top 0.18: NGFF1.35 36.11,71.97 arc-45 35.75,71.09 34.27,69.61 arc-45 33.37,69.24 24.1,69.24 arc-45 23.2,69.61 21.4,71.41 arc45 20.06,71.96 19.68,71.96 arc90 19.14,71.41 19.14,71.35 arc-90 18.95,71.17 18.83,71.17 arc-90 18.65,71.35 18.65,72.05 arc90 18.1,72.6 17.98,72.6 arc90 17.43,72.05 17.43,71.35 arc-90 17.25,71.17 17.12,71.17 arc-90 16.94,71.35 16.94,71.41 arc90 16.39,71.96 10.65,71.96 | X10.9 4.93,68.85 4.95,68.71 5.71,68.71 arc45 6.86,69.18 7.27,69.59 arc45 7.44,70.01 7.44,70.51 arc-45 7.81,71.41 arc-45 9.09,71.96 10.65,71.96 | 10.65,71.96 D8.9
USB3.0_RX_P
  Top 0.18: NGFF1.37 36.61,71.96 arc-45 36.24,71.06 34.42,69.24 arc-45 33.52,68.87 23.95,68.87 arc-45 23.05,69.24 21.14,71.15 arc45 20.06,71.6 19.68,71.6 arc90 19.5,71.41 19.5,71.35 arc-90 18.95,70.8 18.83,70.8 arc-90 18.28,71.35 18.28,71.76 arc90 18.1,71.94 17.98,71.94 arc90 17.79,71.76 17.79,71.35 arc-90 17.25,70.8 17.12,70.8 arc-90 16.57,71.35 16.57,71.41 arc90 16.39,71.6 10.69,71.6 | X10.10 4.8,68.2 4.89,68.29 5.58,68.29 arc45 7.11,68.93 7.53,69.34 arc45 7.8,70.01 7.8,70.51 arc-45 8.07,71.15 arc-45 9.09,71.6 10.69,71.6 | 10.69,71.6 D8.8
USB3.0_TX_N
  Top 0.18: X10.6 4.88,70.8 arc45 5.59,71.09 7.49,73.07 arc-45 8.39,73.44 10.79,73.44 | 10.79,73.44 16.83,73.44 arc90 17.2,73.81 17.2,74.13 arc-90 17.93,74.86 18.26,74.86 arc-90 18.99,74.13 18.99,73.81 arc90 19.36,73.44 19.7,73.44 arc90 20.06,73.81 20.06,74.13 arc-90 20.8,74.86 21.13,74.86 arc-90 21.86,74.13 21.86,73.81 arc90 22.23,73.44 22.34,73.44 arc-45 23.23,73.07 25.42,70.88 arc45 26.32,70.51 32.38,70.51 arc45 33.34,70.9 34.48,72.04 arc45 34.61,72.36 NGFF1.29 | D8.12 10.78,73.48 arc-45 10.79,73.44
USB3.0_TX_P
  Top 0.18: X10.7 4.64,70.15 arc45 5.53,70.52 7.64,72.7 arc-45 8.38,73.08 10.79,73.08 | 10.79,73.08 16.83,73.08 arc90 17.56,73.81 arc-90 17.93,74.17 18.26,74.17 arc-90 18.63,73.81 arc90 19.36,73.08 19.7,73.08 arc90 20.43,73.81 20.43,74.13 arc-90 20.8,74.49 21.13,74.49 arc-90 21.5,74.13 21.5,73.81 arc90 22.23,73.08 arc-45 23.05,72.74 25.27,70.51 arc45 26.17,70.14 32.38,70.14 arc45 33.6,70.64 34.74,71.78 arc45 35.11,72.69 NGFF1.31 | D8.11 10.78,73.07 arc-45 10.79,73.08
USB_VBUS  (via drill 0.3)
  Top 0.406: v6.19,77.79 5.59,77.5 X10.1
  Top 1.016: v7.3,77.79 v6.19,77.79
  Top 1.422: X6.1 v2.86,53.35 v2.86,55.89
  Bottom 1.27: v2.86,55.89 v2.86,54.62
  Bottom 1.422: v2.86,54.62 2.86,62.23 4.13,63.5 4.13,71.75 2.86,73.02 2.86,76.04 4.29,77.79 v6.19,77.79 6.99,77.79
  pour Top (no thermals): 3.49,77.63 3.49,77.31 6.03,77.31 6.03,78.26 5.08,77.63
USIM1_CLK
  Top 0.305: C3.1 R14.2 59.19,46.99
  Top 0.406: SIM1.3 59.19,46.99
USIM1_DATA
  Top 0.305: 76.68,38.42 76.68,34.8 R1.2 | 85.23,46.83 87.76,46.83 C4.1
  Top 0.406: 85.23,46.83 SIM1.7 85,46.74 76.68,38.42 R16.2
USIM1_POWER  (via drill 0.3)
  Top 0.305: NGFF1.36 36.36,62.54 v36.83,62.07 | R1.1 v73.34,35.08 | D1.5 53.02,44.29 54.29,43.02 v56.52,43.02 56.52,41.72 C1.2
  Top 0.406: C1.2 SIM1.1
  Bottom 0.305: v36.83,62.07 38.42,62.07 38.73,62.23 39.37,62.23 39.69,62.07 43.97,62.07 45.88,60.16 46.99,60.16 50.8,56.35 50.8,52.23 56.52,46.51 v56.52,43.02 56.52,41.43 62.87,35.08 v73.34,35.08
USIM2_CLK
  Top 0.305: 59.11,71.98 SIM2.3 58.64,71.98 R19.2 C8.1 54.58,73.79 54.07,73.28 D4.3
USIM2_DATA
  Top 0.305: SIM2.7 85.17,72.07 C9.1 87.63,72.04 R17.2 87.66,70.33 | 84.52,71.98 SIM2.7 | SIM2.7 85.01,71.91 82.87,71.91 79.22,68.26 62.71,68.26 62.39,67.94 57.5,67.94 R13.2 | D4.6 56.86,67.89 R13.2 | R13.2 57.15,67.78
USIM2_POWER
  Top 0.305: D4.5 54.61,66.96 C6.2 57.09,66.01 R13.1 | 59.31,66.9 SIM2.1 58.55,66.07 R13.1 | 60.96,60.8 57.15,64.61 R13.1
  Top 0.61: X4.2 60.96,60.8
VCC_1V8  (via drill 0.3)
  Top 0.305: R10.2 v21.59,82.71 | R6.2 26.99,82.39 v26.67,82.71 | v28.89,81.75 28.89,82.71 R7.2 | R4.2 v27.3,13.02 | v80.96,79.85 80.96,80.99 R20.1 | R11.1 v87.31,61.12
  Top 0.406: U1.5 9.31,66.92 C12.2 v8.41,66.83 | R3.2 14.76,83.98 v15.56,83.18 | v21.27,13.02 20.67,13.62 R5.2 20.67,16.54 v21.59,17.46
  Route15 0.406: v15.56,83.18 21.11,83.18 v21.59,82.71 v26.67,82.71 27.94,82.71 v28.89,81.75
  Bottom 0.305: v8.41,66.83 8.41,66.99 10.16,68.74 10.16,82.07 12.06,83.98 14.76,83.98 v15.56,83.18 | 36.2,11.11 36.2,2.54 | v80.96,79.85 80.96,72.86 87.31,66.52 v87.31,61.12
  Bottom 0.406: v8.41,66.83 8.41,55.01 10.79,52.62 19.05,52.62 22.54,49.13 22.54,18.41 v21.59,17.46 | v21.27,13.02 v27.3,13.02 34.29,13.02 36.2,11.11 | 36.2,2.54 36.51,2.22 40.7,2.22 41.27,2.79 | v28.89,81.75 28.89,85.88 31.75,88.74 49.53,88.74 51.44,86.83 76.83,86.83 80.96,82.71 v80.96,79.85
  Bottom 0.61: 41.27,2.79 42.61,4.13 X3.19
VCC_3V3  (via drill 0.3)
  Top 0.254: U1.3 10.49,69.7 10.32,69.37 10.32,68.74 10.49,68.41 U1.1
  Top 0.305: LED2.A LED1.A | U1.1 12.9,68.41 C10.2
  Top 0.406: LED2.A 10.05,88.63 v9.84,88.42 | v13.02,67.15 C10.2
  other vias: 20.64,41.2 20.64,38.97 17.78,39.92 17.78,42.78 14.92,67.78 16.51,67.78 17.94,67.78 52.7,55.09 54.29,55.09 53.5,54.45 16.51,38.66 16.51,41.2 19.05,41.2
  pour Top (isolate 0.305, no thermals): 14.41,43.58 14.41,36.34 21.21,36.34 21.21,43.58
  pour Top (isolate 0.305, no thermals): 23.27,66.67 28.35,66.67 28.35,64.93 19.37,64.93 18.57,65.72 14.38,65.72 14.38,68.1 18.41,68.1 19.37,67.15 22.48,67.15
  pour Top (isolate 0.305, no thermals): 44.86,66.67 51.91,66.67 54.61,62.39 54.61,53.66 53.02,53.66 52.23,54.45 52.23,63.02 51.12,64.93 44.86,64.93
  pour Route15 (isolate 0.254): 89.92,89.98 -0.25,89.98 -0.25,0.76 89.92,0.76

## Text on the board
Top: M.2 / NGFF WWAN breakout | (C) 2019,2020 sysmocom GmbH / License: CC-BY-SA 4.0
Bottom: M.2 / NGFF WWAN breakout | (C) 2019,2020 sysmocom GmbH / License: CC-BY-SA 4.0
tNames: PCIe x1 / (no USB!) | M.2 / NGFF WWAN breakout | PWR_ON | !W_DIS | !GPS_DIS | !RESET | (C) 2019,2020 sysmocom GmbH / License: CC-BY-SA 4.0 | SIM2 | USB3.0 | 1 | 9 | USB | DC IN | SIM1 | 6V max! | 19 | 1
bNames: M.2 / NGFF WWAN breakout | (C) 2019,2020 sysmocom GmbH / License: CC-BY-SA 4.0